# Altium project Balance_car.PrjPCB
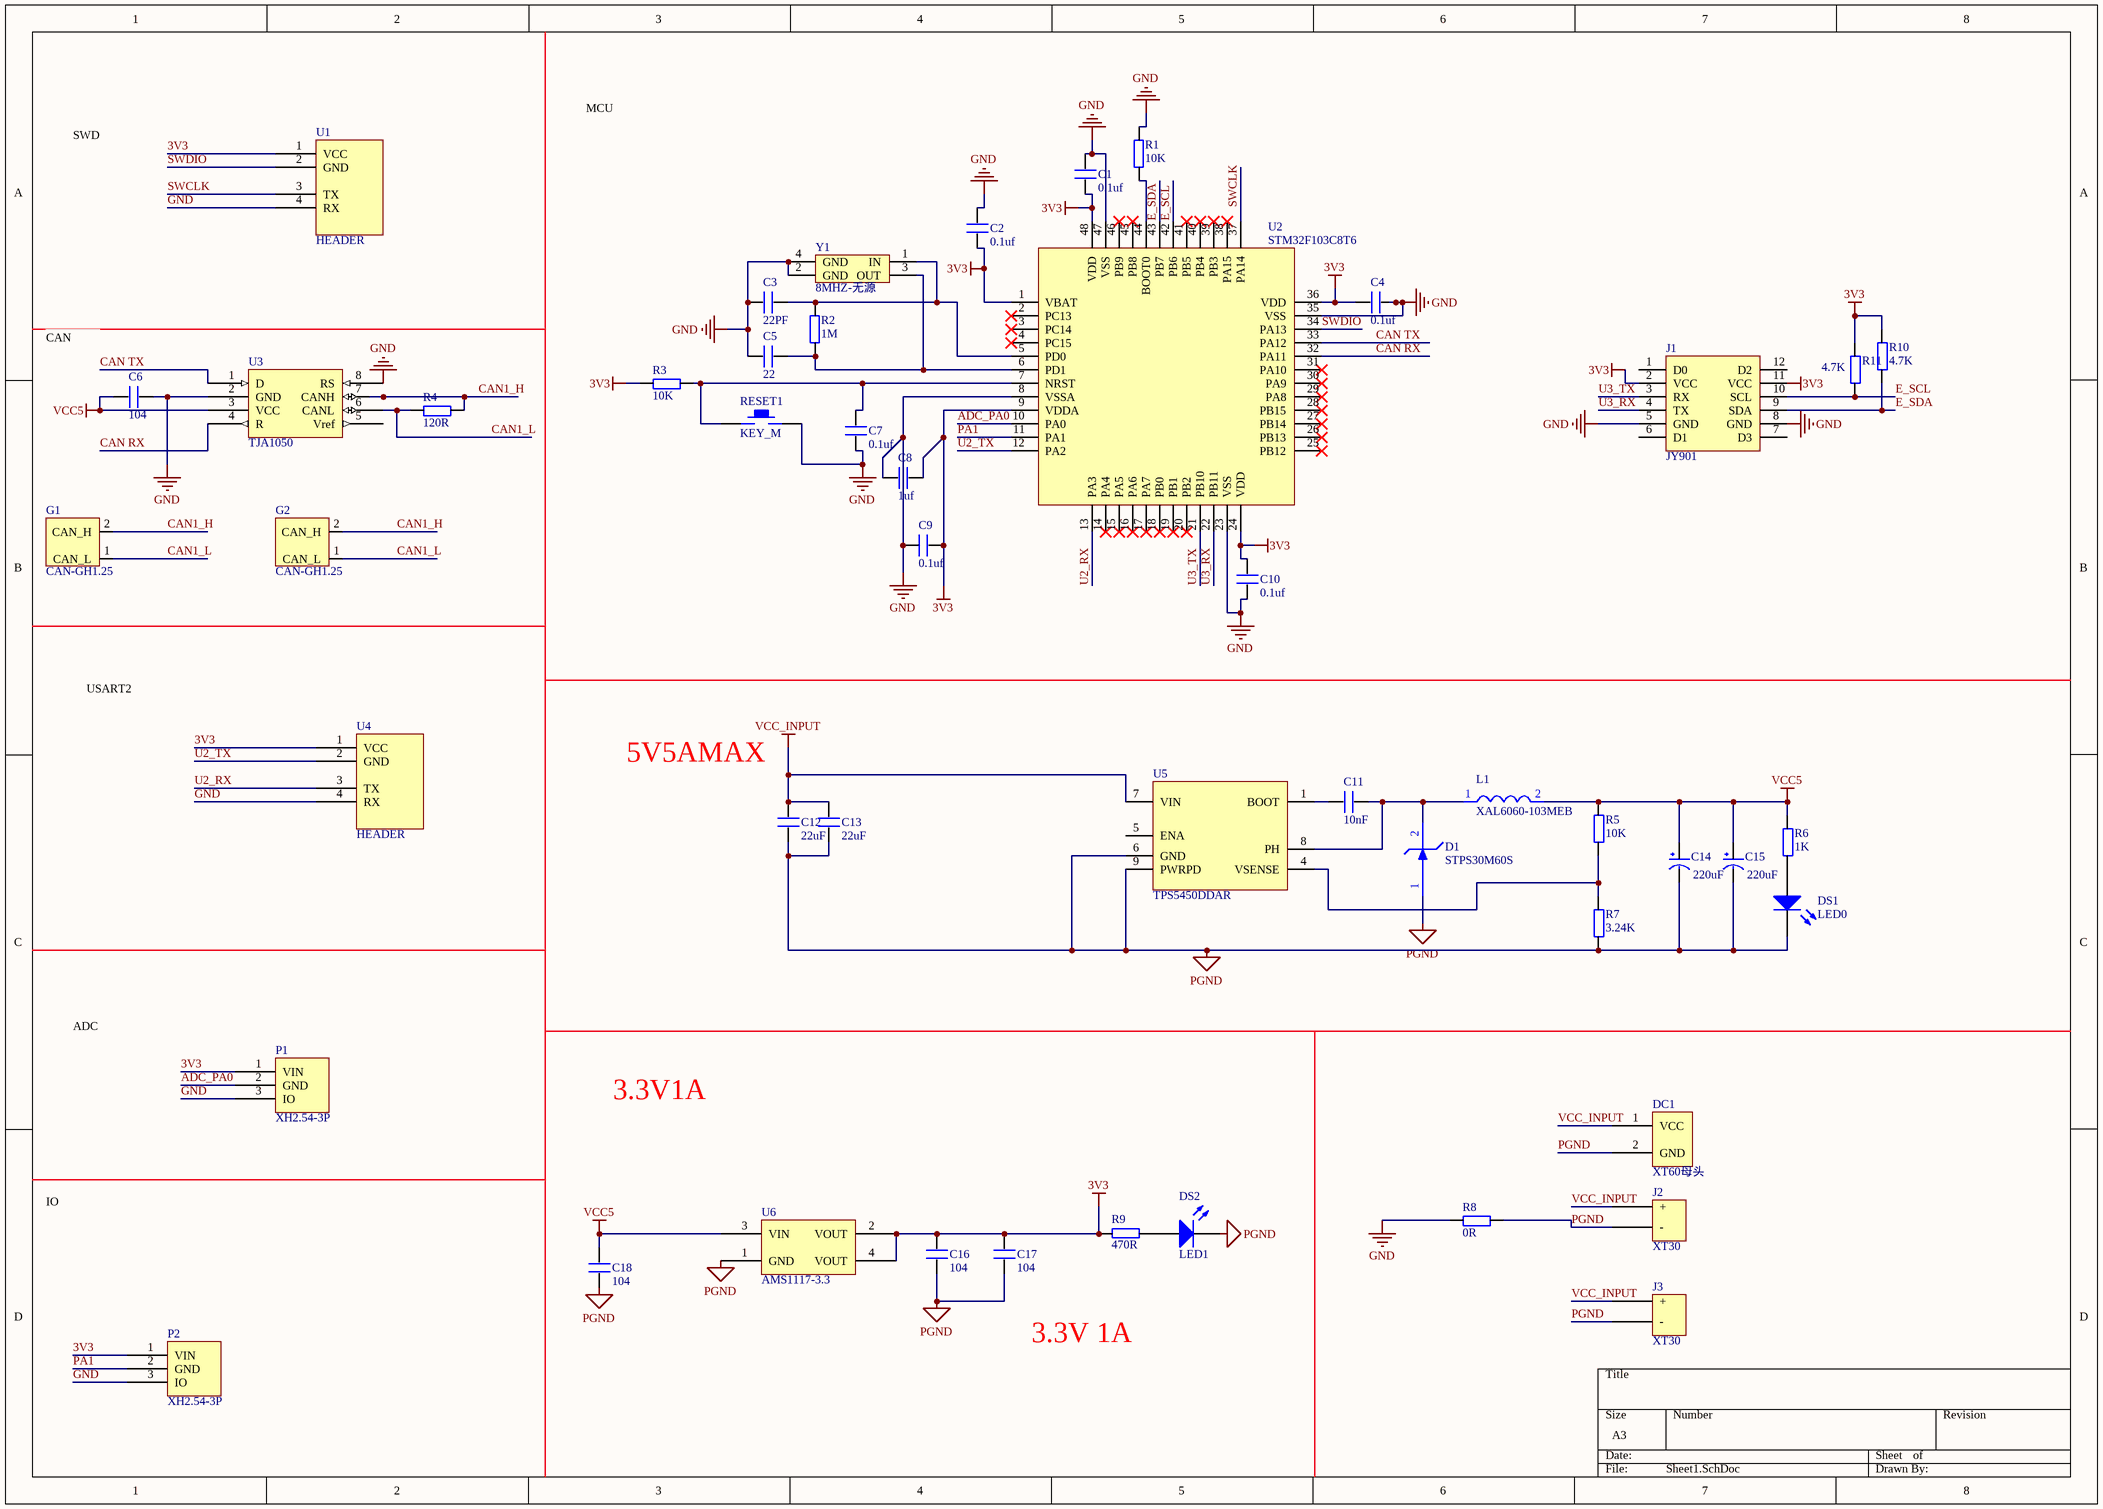
[diagram p0: Sheet1.SchDoc]
1 sheet, 49 parts. Net scope: global (net labels, ports and power ports of the same name join across sheets).
Board file: Balance_car.PcbDoc

## Sheet Sheet1.SchDoc
size A3

### Parts
C1  0.1uf  [0603P]
C2  0.1uf  [0603P]
C3  22PF  [0603P]
C4  0.1uf  [0603P]
C5  22  [0603P]
C6  104  [0603P]
C7  0.1uf  [0603P]
C8  1uf  [0603P]
C9  0.1uf  [0603P]
C10  0.1uf  [0603P]
C11  10nF  [0603P]
C12  22uF  [0603P]
C13  22uF  [0603P]
C14  220uF  [CC6.56.5]
C15  220uF  [CC6.56.5]
C16  104  [0603P]
C17  104  [0603P]
C18  104  [0603P]
D1  STPS30M60S  [STPS30M60S]
DC1  XT60母头  [XT60-母头]
DS1  LED0  [LED-0603-hm]
DS2  LED1  [LED-0603-hm]
G1  CAN-GH1.25  [GH1.25_1*2_lishi]
G2  CAN-GH1.25  [GH1.25_1*2_lishi]
J1  JY901  [JY901]
J2  XT30  [XT30]
J3  XT30  [XT30]
L1  XAL6060-103MEB  [XAL6060-103MEB]
P1  XH2.54-3P  [XH2.54插座-3P]
P2  XH2.54-3P  [XH2.54插座-3P]
R1  10K  [0603P]
R2  1M  [0603P]
R3  10K  [0603P]
R4  120R  [0603P]
R5  10K  [0603P]
R6  1K  [0603P]
R7  3.24K  [0603P]
R8  0R  [0603P]
R9  470R  [0603P]
R10  4.7K  [0603P]
R11  4.7K  [0603P]
RESET1  KEY_M  [KEY_M]
U1  HEADER  [XH2.54插座-4P]
U2  STM32F103C8T6  [LQFP-48_7x7x05P]
U3  TJA1050  [SOP-8]
U4  HEADER  [XH2.54插座-4P]
U5  TPS5450DDAR  [TPS5450]
U6  AMS1117-3.3  [SOT223]
Y1  8MHZ-无源  [XTAL3225   无源]

### Nets
3V3: C1.1 C2.1 C4.2 C8.1 C9.1 C10.2 C16.2 C17.2 J1.2(VCC) J1.11(VCC) P1.1(VIN) P2.1(VIN) R3.1 R9.2 R10.2 R11.2 U1.1(VCC) U2.1(VBAT) U2.9(VDDA) U2.24(VDD) U2.36(VDD) U2.48(VDD) U4.1(VCC) U6.2(VOUT) U6.4(VOUT)
GND: C1.2 C2.2 C3.2 C4.1 C5.2 C6.2 C7.1 C8.2 C9.2 C10.1 J1.5(GND) J1.8(GND) P1.3(IO) P2.3(IO) R1.1 R8.1 RESET1.2 U1.4(RX) U2.8(VSSA) U2.23(VSS) U2.35(VSS) U2.47(VSS) U3.2(GND) U3.8(RS) U4.4(RX) Y1.2(GND) Y1.4(GND)
PGND: C12.1 C13.1 C14.2(GND) C15.2(GND) C16.1 C17.1 C18.1 D1.1(A) DC1.2(GND) DS1.2(K) DS2.2(K) J2.0(-) J3.0(-) R7.1 R8.2 U5.6(GND) U5.9(PWRPD) U6.1(GND)
VCC5: C6.1 C14.1(VCC) C15.1(VCC) C18.2 L1.2(VIN) R5.2 R6.2 U3.3(VCC) U6.3(VIN)
VCC_INPUT: C12.2 C13.2 DC1.1(VCC) J2.1(+) J3.1(+) U5.7(VIN)
ADC_PA0: P1.2(GND) U2.10(PA0)
CAN1_H: G1.2(CAN_H) G2.2(CAN_H) R4.2 U3.7(CANH)
CAN1_L: G1.1(CAN_L) G2.1(CAN_L) R4.1 U3.6(CANL)
CAN RX: U2.32(PA11) U3.4(R)
CAN TX: U2.33(PA12) U3.1(D)
E_SCL: J1.10(SCL) R11.1 U2.42(PB6)
E_SDA: J1.9(SDA) R10.1 U2.43(PB7)
PA1: P2.2(GND) U2.11(PA1)
SWCLK: U1.3(TX) U2.37(PA14)
SWDIO: U1.2(GND) U2.34(PA13)
U2_RX: U2.13(PA3) U4.3(TX)
U2_TX: U2.12(PA2) U4.2(GND)
U3_RX: J1.4(TX) U2.22(PB11)
U3_TX: J1.3(RX) U2.21(PB10)
NetC3_1: C3.1 R2.1 U2.5(PD0) Y1.1(IN)
NetC5_1: C5.1 R2.2 U2.6(PD1) Y1.3(OUT)
NetC7_2: C7.2 R3.2 RESET1.1 U2.7(NRST)
NetC11_1: C11.1 U5.1(BOOT)
NetC11_2: C11.2 D1.2(K) L1.1(VIN) U5.8(PH)
NetDS1_1: DS1.1(A) R6.1
NetDS2_1: DS2.1(A) R9.1
NetR1_2: R1.2 U2.44(BOOT0)
NetR5_1: R5.1 R7.2 U5.4(VSENSE)

Not connected (* = marked no-connect by the designer): J1 1(D0) 6(D1) 7(D3) 12(D2); U2 2(PC13)* 3(PC14)* 4(PC15)* 14(PA4)* 15(PA5)* 16(PA6)* 17(PA7)* 18(PB0)* 19(PB1)* 20(PB2)* 25(PB12)* 26(PB13)* 27(PB14)* 28(PB15)* 29(PA8)* 30(PA9)* 31(PA10)* 38(PA15)* 39(PB3)* 40(PB4)* 41(PB5)* 45(PB8)* 46(PB9)*; U3 5(Vref); U5 5(ENA)

### Notes on the sheet
- SWD
- MCU
- (near C6) CAN
- USART2
- 5V5AMAX
- ADC
- 3.3V1A
- IO
- 3.3V 1A

### Library data of the parts
C1-C13 C16-C18 = C
C14 C15 = CAP
DC1 = XT60-母头
DS1 DS2 = LED2: Typical RED, GREEN, YELLOW, AMBER GaAs LED; Published: 8-Jun-2000; LatestRevisionDate: 17-Jul-2002; LatestRevisionNote: Re-released for DXP Platform.; PackageDocument: Feb-2002; PackageReference: 3.2X1.6X1.1; Publisher: Altium Limited
G1 G2 = GH1.25-CAN
J1 = JY901-PAD
L1 = 贴片电感
P1 P2 = XH2.54插座-3P
R1-R11 = R
U1 U4 = XH2.54插座-4P
U3 = SN65HVD230D
U5 = TPS5450
U6 = AMS1117
Y1 = XTAL-3225